# Altium project ld_system_control.PrjPcb
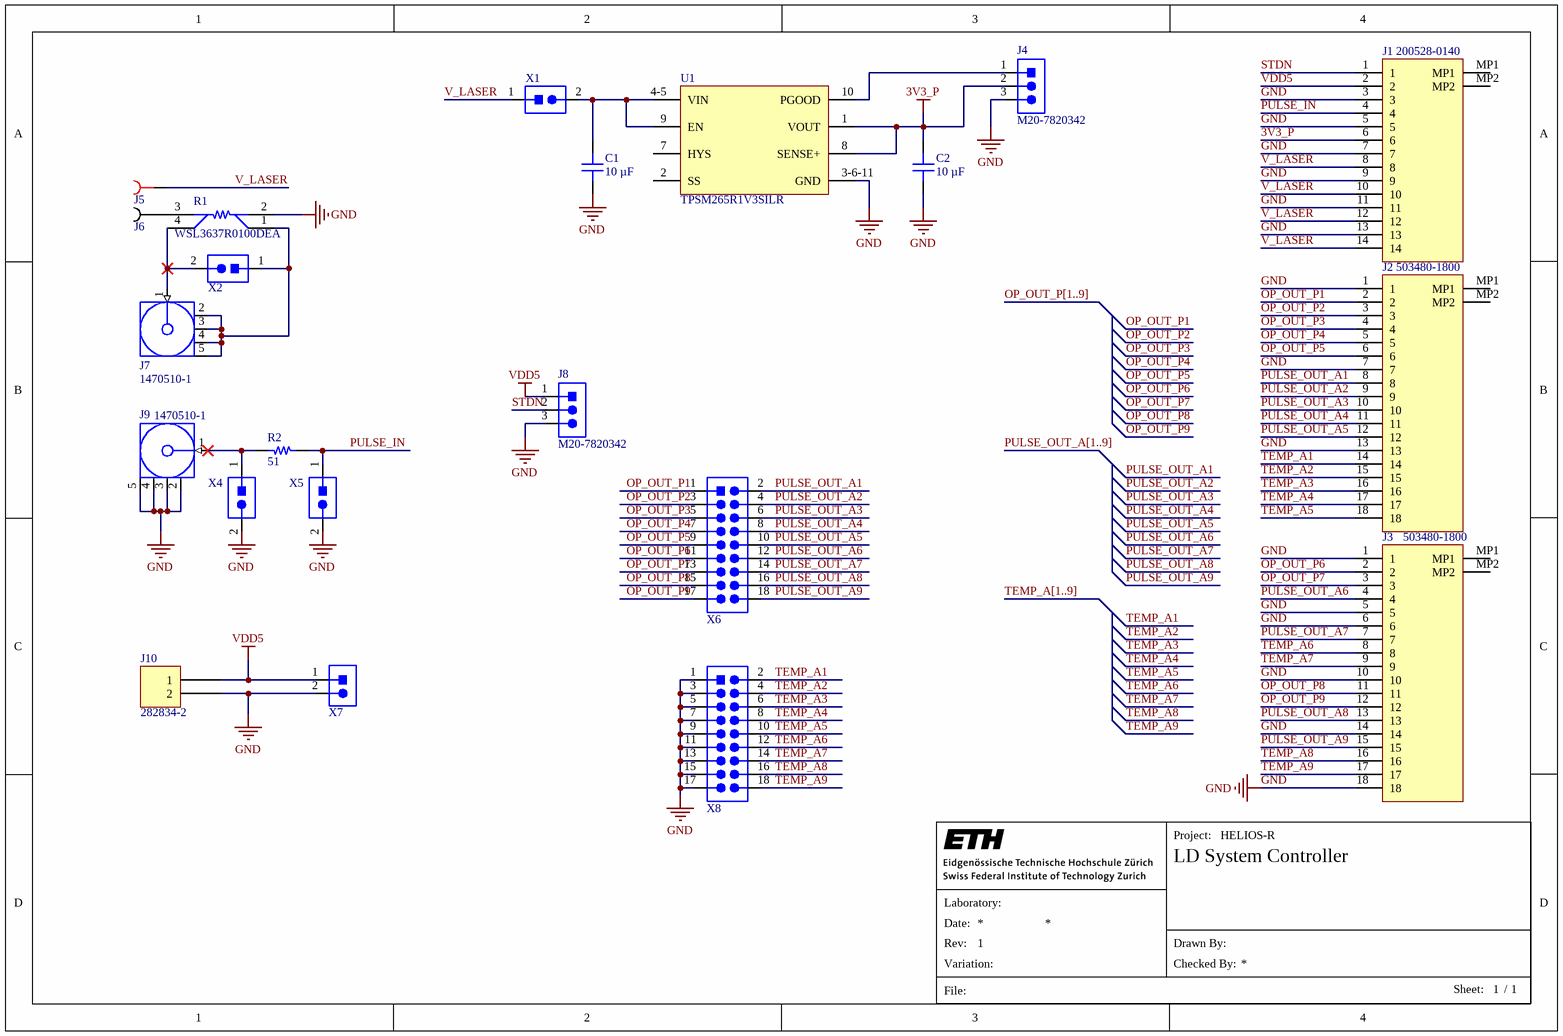
[diagram p0: main.SchDoc]
LAB: IIS; ProjectTitle: HELIOS-R
1 sheet, 22 parts. Net scope: global (net labels, ports and power ports of the same name join across sheets).
Board file: ld_system_control.PcbDoc

## Sheet main.SchDoc: LD System Controller
size A4; Date: 04.08.2023; Author: villanif; CompanyName: IIS; DrawnBy: villanif; Engineer: villanif; Organization: IIS; DocumentNumber: 1; Revision: 1; SheetNumber: 1; SheetTotal: 1; FileInfo: main.SchDoc

### Parts
C1  10 µF  [CAP 1210_3225 - 1MM]
C2  10 µF  [CAP 1210_3225 - 1MM]
J1  200528-0140  [200528-0140]
J2  503480-1800  [5034801800]
J3  503480-1800  [5034801800]
J4  M20-7820342  [HARWIN M20-7820345]
J5  CT3151-2  [CT31510]  (value not drawn)
J6  CT3151-0  [CT31510]  (value not drawn)
J7  1470510-1  [5-1814832-1]
J8  M20-7820342  [HARWIN M20-7820345]
J9  1470510-1  [5-1814832-1]
J10  282834-2  [TE 282834-2]
R1  WSL3637R0100DEA  [WSL3637R0100DEA]
R2  51  [RES 0201_0603]
U1  TPSM265R1V3SILR  [FP-SIL0010C-MFG]
X1  68000-102HLF  [68000-102HLF]  (value not drawn)
X2  68000-102HLF  [68000-102HLF]  (value not drawn)
X4  68000-102HLF  [68000-102HLF]  (value not drawn)
X5  68000-102HLF  [68000-102HLF]  (value not drawn)
X6  68000-102HLF  [TSW-109-07-G-D]  (value not drawn)
X7  68000-102HLF  [68000-102HLF]  (value not drawn)
X8  68000-102HLF  [TSW-109-07-G-D]  (value not drawn)

### Nets
3V3_P: C2.2 J1.6 J4.2 U1.1(VOUT) U1.8(SENSE+)
GND: C1.1 C2.1 J1.3 J1.5 J1.7 J1.9 J1.11 J1.13 J2.1 J2.7 J2.13 J3.1 J3.5 J3.6 J3.10 J3.14 J3.18 J4.3 J8.3 J9.2(GND) J9.3(GND) J9.4(GND) J9.5(GND) J10.2 R1.2 U1.3-6-11(GND) X4.2 X5.2 X7.2 X8.1 X8.3 X8.5 X8.7 X8.9 X8.11 X8.13 X8.15 X8.17
VDD5: J1.2 J8.1 J10.1 X7.1
OP_OUT_P1: J2.2 X6.1
OP_OUT_P2: J2.3 X6.3
OP_OUT_P3: J2.4 X6.5
OP_OUT_P4: J2.5 X6.7
OP_OUT_P5: J2.6 X6.9
OP_OUT_P6: J3.2 X6.11
OP_OUT_P7: J3.3 X6.13
OP_OUT_P8: J3.11 X6.15
OP_OUT_P9: J3.12 X6.17
PULSE_IN: J1.4 R2.2 X5.1
PULSE_OUT_A1: J2.8 X6.2
PULSE_OUT_A2: J2.9 X6.4
PULSE_OUT_A3: J2.10 X6.6
PULSE_OUT_A4: J2.11 X6.8
PULSE_OUT_A5: J2.12 X6.10
PULSE_OUT_A6: J3.4 X6.12
PULSE_OUT_A7: J3.7 X6.14
PULSE_OUT_A8: J3.13 X6.16
PULSE_OUT_A9: J3.15 X6.18
STDN: J1.1 J8.2
TEMP_A1: J2.14 X8.2
TEMP_A2: J2.15 X8.4
TEMP_A3: J2.16 X8.6
TEMP_A4: J2.17 X8.8
TEMP_A5: J2.18 X8.10
TEMP_A6: J3.8 X8.12
TEMP_A7: J3.9 X8.14
TEMP_A8: J3.16 X8.16
TEMP_A9: J3.17 X8.18
V_LASER: J1.8 J1.10 J1.12 J1.14 J5.1 X1.1
NetC1_2: C1.2 U1.4-5(VIN) U1.9(EN) X1.2
NetJ4_1: J4.1 U1.10(PGOOD)
NetJ6_1: J6.1 R1.3
NetJ7_1: J7.1(Signal) R1.4 X2.2
NetJ7_2: J7.2(GND) J7.3(GND) J7.4(GND) J7.5(GND) R1.1 X2.1
NetJ9_1: J9.1(Signal) R2.1 X4.1

Not connected (* = marked no-connect by the designer): J1 MP1 MP2; J2 MP1 MP2; J3 MP1 MP2; U1 2(SS) 7(HYS)

### Buses and harness runs
bus OP_OUT_P[1..9]
bus PULSE_OUT_A[1..9]
bus TEMP_A[1..9]

### Notes on the sheet
- Project:
- Laboratory:
- Date:
- File:
- Rev:
- Variation:
- Drawn By:
- Checked By:
- Sheet:
- /

### Library data of the parts
C1 C2 = GRM32EC72A106ME05L: CAP CER 10UF 100V X7S 1210; manufacturer: Murata Electronics; Tolerance: ±20%; Part Number: GRM32EC72A106ME05L; Applications: General Purpose; Capacitance: 10 µF; componentlink1description: Datasheet; componentlink1url: https://search.murata.co.jp/Ceramy/image/img/A01X/G101/ENG/GRM32EC72A106ME05-01A.pdf; componentlink2description: DigiKey Link; componentlink2url: https://www.digikey.com/en/products/detail/murata-electronics/GRM32EC72A106ME05L/16033383; Device Package: 1210 (3225 Metric); lastupdated: 16/07/2023 19:11:38; Lifecycle Status: Active; Minimum Order: 1; Mounting Type: Surface Mount, MLCC; Operating Temperature: -55°C ~ 125°C; Package / Case: 1210 (3225 Metric); packaging: TapeAndReel; partid: 44868; Part Status: Active; price: 0.28; series: GRM; Size / Dimension: 0.126" L x 0.098" W (3.20mm x 2.50mm); Supplier 1: Digi-Key; Supplier Part Number 1: 490-GRM32EC72A106ME05LCT-ND; Temperature Coefficient: X7S; Thickness (Max): 0.106" (2.70mm); Voltage - Rated: 100V; Value: 10 µF
J1 = 522071460: FFC / FPC Board Connector, 1 mm, 14 Contacts, Receptacle, Easy-On 52207 Series, Surface Mount; Manufacturer: Molex; Manufacturer Part Number: 52207-1460; Manufacturer Lifecycle Status: ACTIVE; Contact Resistance: 20mΩ; Current Rating: 1A; Dielectric Material: Polyamide; Insulation Resistance: 100MΩ; Number of Circuits: 14; Pitch: 1mm; Plating: Tin; Plating Thickness: 101.6nm; Stackable: No; Voltage Rating: 125V; Supplier 1: Mouser; RoHS: Compliant; Category: FFC / FPC; Stock 1: 4427; Pricing 1: 1=1.59, 10=1.36, 50=1.21, 100=1.16, 1000=0.977, 10000=0.931 (USD); China RoHS: Compliant; Contact Gender: Female; Contact Material: Bronze; Contact Plating: Gold; Country of Origin: MY; Depth: 7.5mm; ELV: Compliant; Flammability Rating: UL94 V-0; Gender: Receptacle; Length: 21.5mm; Lifecycle Status: Production; Max Operating Temperature: 85°C; Min Operating Temperature: -30°C; Mounting Technology: Surface Mount; Number of Contacts: 14; Pins: 14; Number of Positions: 14; Number of Rows: 1; Orientation: Right Angle; Packaging: Tape and Reel; REACH SVHC: Yes; Schedule B: 8536694040, 8536694040|8536694040|8536694040|8536694040|8536694040; Terminal Pitch: 1mm; Termination: SMD/SMT; ComponentLink1URL: https://datasheet.octopart.com:443/52207-1460-Molex-datasheet-142104640.pdf?src-supplier=IHS; ComponentLink1Description: https://datasheet.octopart.com:443/52207-1460-Molex-datasheet-142104640.pdf?src-supplier=IHS; ComponentLink2URL: https://datasheet.octopart.com:443/52207-1460-Molex-datasheet-13776660.pdf?src-supplier=Sager+Electronics; ComponentLink2Description: https://datasheet.octopart.com:443/52207-1460-Molex-datasheet-13776660.pdf?src-supplier=Sager+Electronics; ComponentLink3URL: https://sigma.octopart.com:443/15648958/technical_drawing/Molex-52207-1460.pdf?src-supplier=Molex; ComponentLink3Description: https://sigma.octopart.com:443/15648958/technical_drawing/Molex-52207-1460.pdf?src-supplier=Molex; ComponentLink4URL: https://datasheet.octopart.com:443/522071460-Molex-datasheet-8339709.pdf?src-supplier=Farnell; ComponentLink4Description: https://datasheet.octopart.com:443/522071460-Molex-datasheet-8339709.pdf?src-supplier=Farnell; ComponentLink5URL: https://datasheet.octopart.com:443/52207-1460-Molex-datasheet-101583306.pdf?src-supplier=Farnell; ComponentLink5Description: https://datasheet.octopart.com:443/52207-1460-Molex-datasheet-101583306.pdf?src-supplier=Farnell; ComponentLink6URL: https://datasheet.octopart.com:443/52207-1460-Molex-datasheet-11535635.pdf?src-supplier=element14+APAC; ComponentLink6Description: https://datasheet.octopart.com:443/52207-1460-Molex-datasheet-11535635.pdf?src-supplier=element14+APAC; ComponentLink7URL: https://datasheet.octopart.com:443/52207-1460-Molex-datasheet-168216957.pdf?src-supplier=TME; ComponentLink7Description: https://datasheet.octopart.com:443/52207-1460-Molex-datasheet-168216957.pdf?src-supplier=TME; ComponentLink8URL: https://datasheet.octopart.com:443/52207-1460-Molex-datasheet-140186224.pdf?src-supplier=RS+(Formerly+Allied+Electronics); ComponentLink8Description: https://datasheet.octopart.com:443/52207-1460-Molex-datasheet-140186224.pdf?src-supplier=RS+(Formerly+Allied+Electronics); ComponentLink9URL: https://datasheet.octopart.com:443/52207-1460-Molex-datasheet-120153299.pdf?src-supplier=RS+(Formerly+Allied+Electronics); ComponentLink9Description: https://datasheet.octopart.com:443/52207-1460-Molex-datasheet-120153299.pdf?src-supplier=RS+(Formerly+Allied+Electronics); ComponentLink10URL: https://datasheet.octopart.com:443/52207-1460-Molex-datasheet-32997471.pdf?src-supplier=RS+(Formerly+Allied+Electronics); ComponentLink10Description: https://datasheet.octopart.com:443/52207-1460-Molex-datasheet-32997471.pdf?src-supplier=RS+(Formerly+Allied+Electronics); ComponentLink11URL: http://sigma.octopart.com:80/15648969/rohs_certificate/Molex-52207-1460.pdf?src-supplier=Compliance+Statements; ComponentLink11Description: http://sigma.octopart.com:80/15648969/rohs_certificate/Molex-52207-1460.pdf?src-supplier=Compliance+Statements; ComponentLink12URL: http://sigma.octopart.com:80/conflict_mineral_statement/Molex-company-72.pdf?src-supplier=Compliance+Statements; ComponentLink12Description: http://sigma.octopart.com:80/conflict_mineral_statement/Molex-company-72.pdf?src-supplier=Compliance+Statements; ComponentLink13URL: http://sigma.octopart.com:80/reach_statement/Molex-company-74.pdf?src-supplier=Compliance+Statements; ComponentLink13Description: http://sigma.octopart.com:80/reach_statement/Molex-company-74.pdf?src-supplier=Compliance+Statements; ComponentLink14URL: http://sigma.octopart.com:80/rohs_statement/Molex-company-73.pdf?src-supplier=Compliance+Statements; ComponentLink14Description: http://sigma.octopart.com:80/rohs_statement/Molex-company-73.pdf?src-supplier=Compliance+Statements; Supplier Part Number 1: 538-52207-1460
J2 J3 = 503480-1800: Conn FPC  18 POS 0.5mm; Manufacturer: Molex; Supplier 1: Mouser; Manufacturer Part Number: 5034801800; RoHS: Yes; Category: FFC / FPC; Stock 1: 17529; Pricing 1: 1=1.48, 10=1.23, 50=1.23, 100=1.06, 1000=0.885, 10000=0.766 (USD); ComponentLink1URL: https://datasheet.ciiva.com/671/5034800400-sd-671136.pdf?src-supplier=Digi-Key; ComponentLink1Description: https://datasheet.ciiva.com/671/5034800400-sd-671136.pdf?src-supplier=Digi-Key; ComponentLink2URL: https://datasheet.ciiva.com/10366/5034801800-ffc-fpc-connectors-10366583.pdf?src-supplier=Avnet; ComponentLink2Description: https://datasheet.ciiva.com/10366/5034801800-ffc-fpc-connectors-10366583.pdf?src-supplier=Avnet; ComponentLink3URL: https://datasheet.ciiva.com/5137/5034801800-ffc-fpc-connectors-179548-5137672.pdf?src-supplier=Mouser; ComponentLink3Description: https://datasheet.ciiva.com/5137/5034801800-ffc-fpc-connectors-179548-5137672.pdf?src-supplier=Mouser; Supplier Part Number 1: 538-503480-1800
J4 J8 = M20-7820342: Header 3 Positions, Unshrouded Connector 0.100" (2.54mm) Through Hole Gold or Gold, GXT™; Manufacturer: Harwin Inc.; Connector Type: Receptacle; Contact Length - Post: 0.118" (3.00mm); Current Rating (Amps): 3A; Mated Stacking Heights: 11.04mm, 12.63mm; Material Flammability Rating: UL94 V-0; Number of Positions: 3; Number of Positions Loaded: All; Style: Board to Board or Cable; Part Number: M20-7820342; ComponentLink1Description: Datasheet; ComponentLink1URL: https://cdn.harwin.com/pdfs/Harwin_PC_Connectors_M20.pdf; ComponentLink2Description: DigiKey Link; ComponentLink2URL: https://www.digikey.com/en/products/detail/harwin-inc/M20-7820342/3727752; Contact Finish - Mating: Gold; Contact Finish - Post: Tin; Contact Finish Thickness - Mating: Flash; Contact Type: Female Socket; Fastening Type: Push-Pull; Insulation Color: Black; Insulation Height: 0.335" (8.51mm); LastUpdated: 21/09/2022 18:55:13; Lifecycle Status: Active; Minimum Order: 1; Mounting Type: Through Hole; Number of Rows: 1; Operating Temperature: -40°C ~ 105°C; Packaging: Tube; Part Status: Active; Pitch - Mating: 0.100" (2.54mm); Price: 0.42; Series: M20; Supplier 1: DigiKey; Supplier Part Number 1: 952-1783-ND; Termination: Solder
J5 = CT3151-2: Banana plug connector - Red; pin to pad: 1>1+2+3+4; Manufacturer: Cal Test Electronics; Supplier 1: Mouser; Manufacturer Part Number: CT3151-2; RoHS: Yes; Category: Connectors; Pricing 1: 1=2.45, 10=2.45, 50=2.45, 100=2.45, 1000=2.45, 10000=2.45 (USD); Reach SVHC Compliant: Yes; ComponentLink1URL: http://www.caltestelectronics.com/images/attachments/P315100rH_drawing.pdf?src-supplier=Digikey; ComponentLink1Description: http://www.caltestelectronics.com/images/attachments/P315100rH_drawing.pdf?src-supplier=Digikey; Supplier Part Number 1: 510-CT3151-2
J6 = CT3151-0: Banana plug connector - Black; pin to pad: 1>1+2+3+4; Manufacturer: Cal Test Electronics; Supplier 1: Mouser; Manufacturer Part Number: CT3151-0; RoHS: Yes; Category: Connectors; Stock 1: 3249; Pricing 1: 1=2.45, 10=2.45, 50=2.45, 100=2.45, 1000=2.45, 10000=2.45 (USD); Reach SVHC Compliant: Yes; ComponentLink1URL: http://www.caltestelectronics.com/images/attachments/P315100rH_drawing.pdf?src-supplier=Digikey; ComponentLink1Description: http://www.caltestelectronics.com/images/attachments/P315100rH_drawing.pdf?src-supplier=Digikey; Supplier Part Number 1: 510-CT3151-0
J7 J9 = CMP-00606-1: SMA Connector Jack, Female Socket 50 Ohm Through Hole Solder; Manufacturer: TE Connectivity; Body Material: Brass; Dielectric Material: PTFE; Frequency: 6GHz; Gender: Male; Connector Type: SMA,Jack; Impedance: 50R; PCB Mounting Orientation: Vertical; Mount: Through Hole; Case/Package: SMA; Termination: Solder; Orientation: Straight; Packaging: Bag; Package Quantity: 100; Length: 13.97mm; Radiation Hardening: No; ELV: Compliant; Manufacturer Part Number: 1470510-1; Supplier: Digi-Key; Supplier Part Number: A119269-ND; ComponentLink1Description: 1470510-1?RQPN=1470510-1; ComponentLink1URL: http://www.te.com/catalog/pn/en/1470510-1?RQPN=1470510-1
J10 = 282834-2: TERM BLK 2P SIDE ENT 2.54MM PCB; Manufacturer: TE Connectivity AMP Connectors; Current: 10A; Mating Orientation: Horizontal with Board; Number of Levels: 1; Pitch: 0.100" (2.54mm); Positions Per Level: 2; Voltage: 150V; Wire Gauge: 16-30 AWG; Wire Termination: Screw - Rising Cage Clamp; Part Number: 282834-2; Color: Green; ComponentLink1Description: Datasheet; ComponentLink1URL: https://www.te.com/commerce/DocumentDelivery/DDEController?Action=srchrtrv&DocNm=282834&DocType=Customer+Drawing&DocLang=English; ComponentLink2Description: DigiKey Link; ComponentLink2URL: http://digikey.com/product-detail/en/te-connectivity-amp-connectors/282834-2/A98333-ND/1150135; LastUpdated: 15/01/2020 04:15:38; Lifecycle Status: Active; Minimum Order: 1; Mounting Type: Through Hole; Packaging: Bulk; Part Status: Active; Price: 0.88; Series: Buchanan; Supplier 1: DigiKey; Supplier Part Number 1: A98333-ND
R1 = WSL3637R0100DEA: current measurement Resistor; Manufacturer_Name: Vishay; Datasheet Link: https://componentsearchengine.com/Datasheets/1/WSL3637R0100DEA.pdf; Height: 0.889mm; Manufacturer_Part_Number: WSL3637R0100DEA; Mouser Part Number: 71-WSL3637R0100DEA; Mouser Price/Stock: https://www.mouser.co.uk/ProductDetail/Vishay-Dale/WSL3637R0100DEA?qs=5qr1tyFj3NLzr0u0T49OJA%3D%3D; Arrow Part Number: WSL3637R0100DEA; Arrow Price/Stock: https://www.arrow.com/en/products/wsl3637r0100dea/vishay; Supplier 1: Mouser; Supplier Part Number 1: 71-WSL3637R0100DEA
R2 = ERJ-1GNF51R0C: RES SMD 51 OHM 1% 1/20W 0201; Manufacturer: Panasonic; Manufacturer Part Number: ERJ1GNF51R0C; Power: 50mW; Rated Temperature: 70°C; Temperature Coefficient: 200ppm/°C; Working Voltage: 25V; Package Height: 0.23mm; Package Length: 0.6mm; Package Width: 0.3mm; Reference Standard: AEC-Q200; Supplier: Mouser; Supplier Part Number: 667-ERJ-1GNF51R0C; RoHS: Yes; Category: Chip SMD Resistors; Stock: 39473; Pricing: 1=0.1, 10=0.033, 50=0.033, 100=0.015, 1000=0.011, 10000=0.007 (USD); Mounting Technology: Surface Mount; Pins: 2; Package Shape: Rectangular; Case/Package: 0201; Terminal Finish: Nickel; Min Operating Temperature: -55°C; Max Operating Temperature: 125°C; Tolerance: 1%; JESD-609 Code: e3; Resistor Type: FIXED RESISTOR; Construction: Rectangular; Package Style: SMTMeter; Packaging: Tape and Reel; Value: 51; Technology: METAL GLAZE/THICK FILM; Termination: Wraparound; Reach SVHC Compliant: Yes; RoHS Compliant: Yes; ComponentLink1URL: https://datasheet.ciiva.com:443/pdfs/VipMasterIC/IC/PANA/PANA-S-A0009889626/PANA-S-A0009889626-1.pdf?src-supplier=IHS+Markit; ComponentLink1Description: https://datasheet.ciiva.com:443/pdfs/VipMasterIC/IC/PANA/PANA-S-A0009889626/PANA-S-A0009889626-1.pdf?src-supplier=IHS+Markit; ComponentLink2URL: https://datasheet.ciiva.com/43467/1678782-43467023.pdf?src-supplier=Farnell; ComponentLink2Description: https://datasheet.ciiva.com/43467/1678782-43467023.pdf?src-supplier=Farnell; ComponentLink3URL: https://datasheet.ciiva.com/24130/aoa0000ce2-24130655.pdf?src-supplier=Mouser; ComponentLink3Description: https://datasheet.ciiva.com/24130/aoa0000ce2-24130655.pdf?src-supplier=Mouser; ComponentLink4URL: https://datasheet.ciiva.com/46375/1678782-46375932.pdf?src-supplier=Element14; ComponentLink4Description: https://datasheet.ciiva.com/46375/1678782-46375932.pdf?src-supplier=Element14; ComponentLink5URL: https://datasheet.ciiva.com/7891/aoa0000ce2-7891288.pdf?src-supplier=Element14; ComponentLink5Description: https://datasheet.ciiva.com/7891/aoa0000ce2-7891288.pdf?src-supplier=Element14; Supplier 1: Mouser; Supplier Part Number 1: 667-ERJ-1GNF51R0C
U1 = TPSM265R1V3SILR: 3-V TO 65-V INPUT, 100-MA, STEP-; Manufacturer: Texas Instruments; Supplier 1: Mouser; Manufacturer Part Number: TPSM265R1V3SILR; RoHS: Yes; Category: Voltage Regulators - Switching; Stock 1: 6360; Pricing 1: 1=4.24, 10=3.61, 50=3.61, 100=3.13, 1000=2.25, 10000=2.13 (USD); Supplier Part Number 1: 595-TPSM265R1V3SILR
X1 X2 X4 X5 = CMP-00100-3_1: Header 2 Positions , Unshrouded Connector 0.100" (2.54mm) Through Hole Gold or Gold, GXT™; Manufacturer: Amphenol FCI; Number of Positions: 2; Connector Type: Male Pin; Current Rating: 3A; Gender: Male; Insulation Resistance: 5GR; Mating Post Length: 5.84mm; Max Voltage Rating (AC): 1.5kV; Packaging: Bulk; Supplier: Digikey; Supplier Part Number: 609-3500-ND; ComponentLink1Description: 68000-274228-5149165.pdf; ComponentLink1URL: https://datasheet.ciiva.com/5149/68000-274228-5149165.pdf; Pitch: 2.54mm; Manufacturer Part Number: 68000-102HLF; Number of Rows: 1; Termination: Solder; Contact Mating Length: 0.23inch; Case/Package: 100; Colour: Black; ComponentLink2Description: 68000-722084.pdf; ComponentLink2URL: https://datasheet.ciiva.com/722/68000-722084.pdf; ComponentLink3Description: 68000-10149324.pdf; ComponentLink3URL: https://datasheet.ciiva.com/10149/68000-10149324.pdf; ComponentLink4Description: 68000-16726309.pdf; ComponentLink4URL: https://datasheet.ciiva.com/16726/68000-16726309.pdf; Contact Gender: Male; Contact Material: Bronze; Contact Plating: Nickel,Gold,GXT; Depth: 2.41mm; Flammability Rating: UL94 V-0; Housing Colour: Black; Housing Material: Thermoplastic; Lead Free: Lead Free; Length: 5.08mm; Max Operating Temperature: 125°C; Min Operating Temperature: -65°C; Number of Contacts: 2; Orientation: Straight; Package Quantity: 100; Radiation Hardening: No; Termination Post Length: 2.41mm; Voltage Rating: 1.5kV; Voltage Rating (DC): 1.5kV
X6 X8 = 68000-102HLF: Header 9*2 Positions, Unshrouded Connector 0.100" (2.54mm) Through Hole Gold or Gold, GXT™; Manufacturer: Amphenol FCI; Number of Positions: 2; Connector Type: Male Pin; Current Rating: 3A; Gender: Male; Insulation Resistance: 5GR; Mating Post Length: 5.84mm; Max Voltage Rating (AC): 1.5kV; Packaging: Bulk; Supplier: Digikey; Supplier Part Number: 609-3500-ND; ComponentLink1Description: 68000-274228-5149165.pdf; ComponentLink1URL: https://datasheet.ciiva.com/5149/68000-274228-5149165.pdf; Pitch: 2.54mm; Manufacturer Part Number: 68000-102HLF; Number of Rows: 1; Termination: Solder; Contact Mating Length: 0.23inch; Case/Package: 100; Colour: Black; ComponentLink2Description: 68000-722084.pdf; ComponentLink2URL: https://datasheet.ciiva.com/722/68000-722084.pdf; ComponentLink3Description: 68000-10149324.pdf; ComponentLink3URL: https://datasheet.ciiva.com/10149/68000-10149324.pdf; ComponentLink4Description: 68000-16726309.pdf; ComponentLink4URL: https://datasheet.ciiva.com/16726/68000-16726309.pdf; Contact Gender: Male; Contact Material: Bronze; Contact Plating: Nickel,Gold,GXT; Depth: 2.41mm; Flammability Rating: UL94 V-0; Housing Colour: Black; Housing Material: Thermoplastic; Lead Free: Lead Free; Length: 5.08mm; Max Operating Temperature: 125°C; Min Operating Temperature: -65°C; Number of Contacts: 2; Orientation: Straight; Package Quantity: 100; Radiation Hardening: No; Termination Post Length: 2.41mm; Voltage Rating: 1.5kV; Voltage Rating (DC): 1.5kV
X7 = CMP-00100-3: Header 2 positions, Unshrouded Connector 0.100" (2.54mm) Through Hole Gold or Gold, GXT™; Manufacturer: Amphenol FCI; Number of Positions: 2; Connector Type: Male Pin; Current Rating: 3A; Gender: Male; Insulation Resistance: 5GR; Mating Post Length: 5.84mm; Max Voltage Rating (AC): 1.5kV; Packaging: Bulk; Supplier: Digikey; Supplier Part Number: 609-3500-ND; ComponentLink1Description: 68000-274228-5149165.pdf; ComponentLink1URL: https://datasheet.ciiva.com/5149/68000-274228-5149165.pdf; Pitch: 2.54mm; Manufacturer Part Number: 68000-102HLF; Number of Rows: 1; Termination: Solder; Contact Mating Length: 0.23inch; Case/Package: 100; Colour: Black; ComponentLink2Description: 68000-722084.pdf; ComponentLink2URL: https://datasheet.ciiva.com/722/68000-722084.pdf; ComponentLink3Description: 68000-10149324.pdf; ComponentLink3URL: https://datasheet.ciiva.com/10149/68000-10149324.pdf; ComponentLink4Description: 68000-16726309.pdf; ComponentLink4URL: https://datasheet.ciiva.com/16726/68000-16726309.pdf; Contact Gender: Male; Contact Material: Bronze; Contact Plating: Nickel,Gold,GXT; Depth: 2.41mm; Flammability Rating: UL94 V-0; Housing Colour: Black; Housing Material: Thermoplastic; Lead Free: Lead Free; Length: 5.08mm; Max Operating Temperature: 125°C; Min Operating Temperature: -65°C; Number of Contacts: 2; Orientation: Straight; Package Quantity: 100; Radiation Hardening: No; Termination Post Length: 2.41mm; Voltage Rating: 1.5kV; Voltage Rating (DC): 1.5kV